# EAGLE design mainboard (EAGLE 5.11)
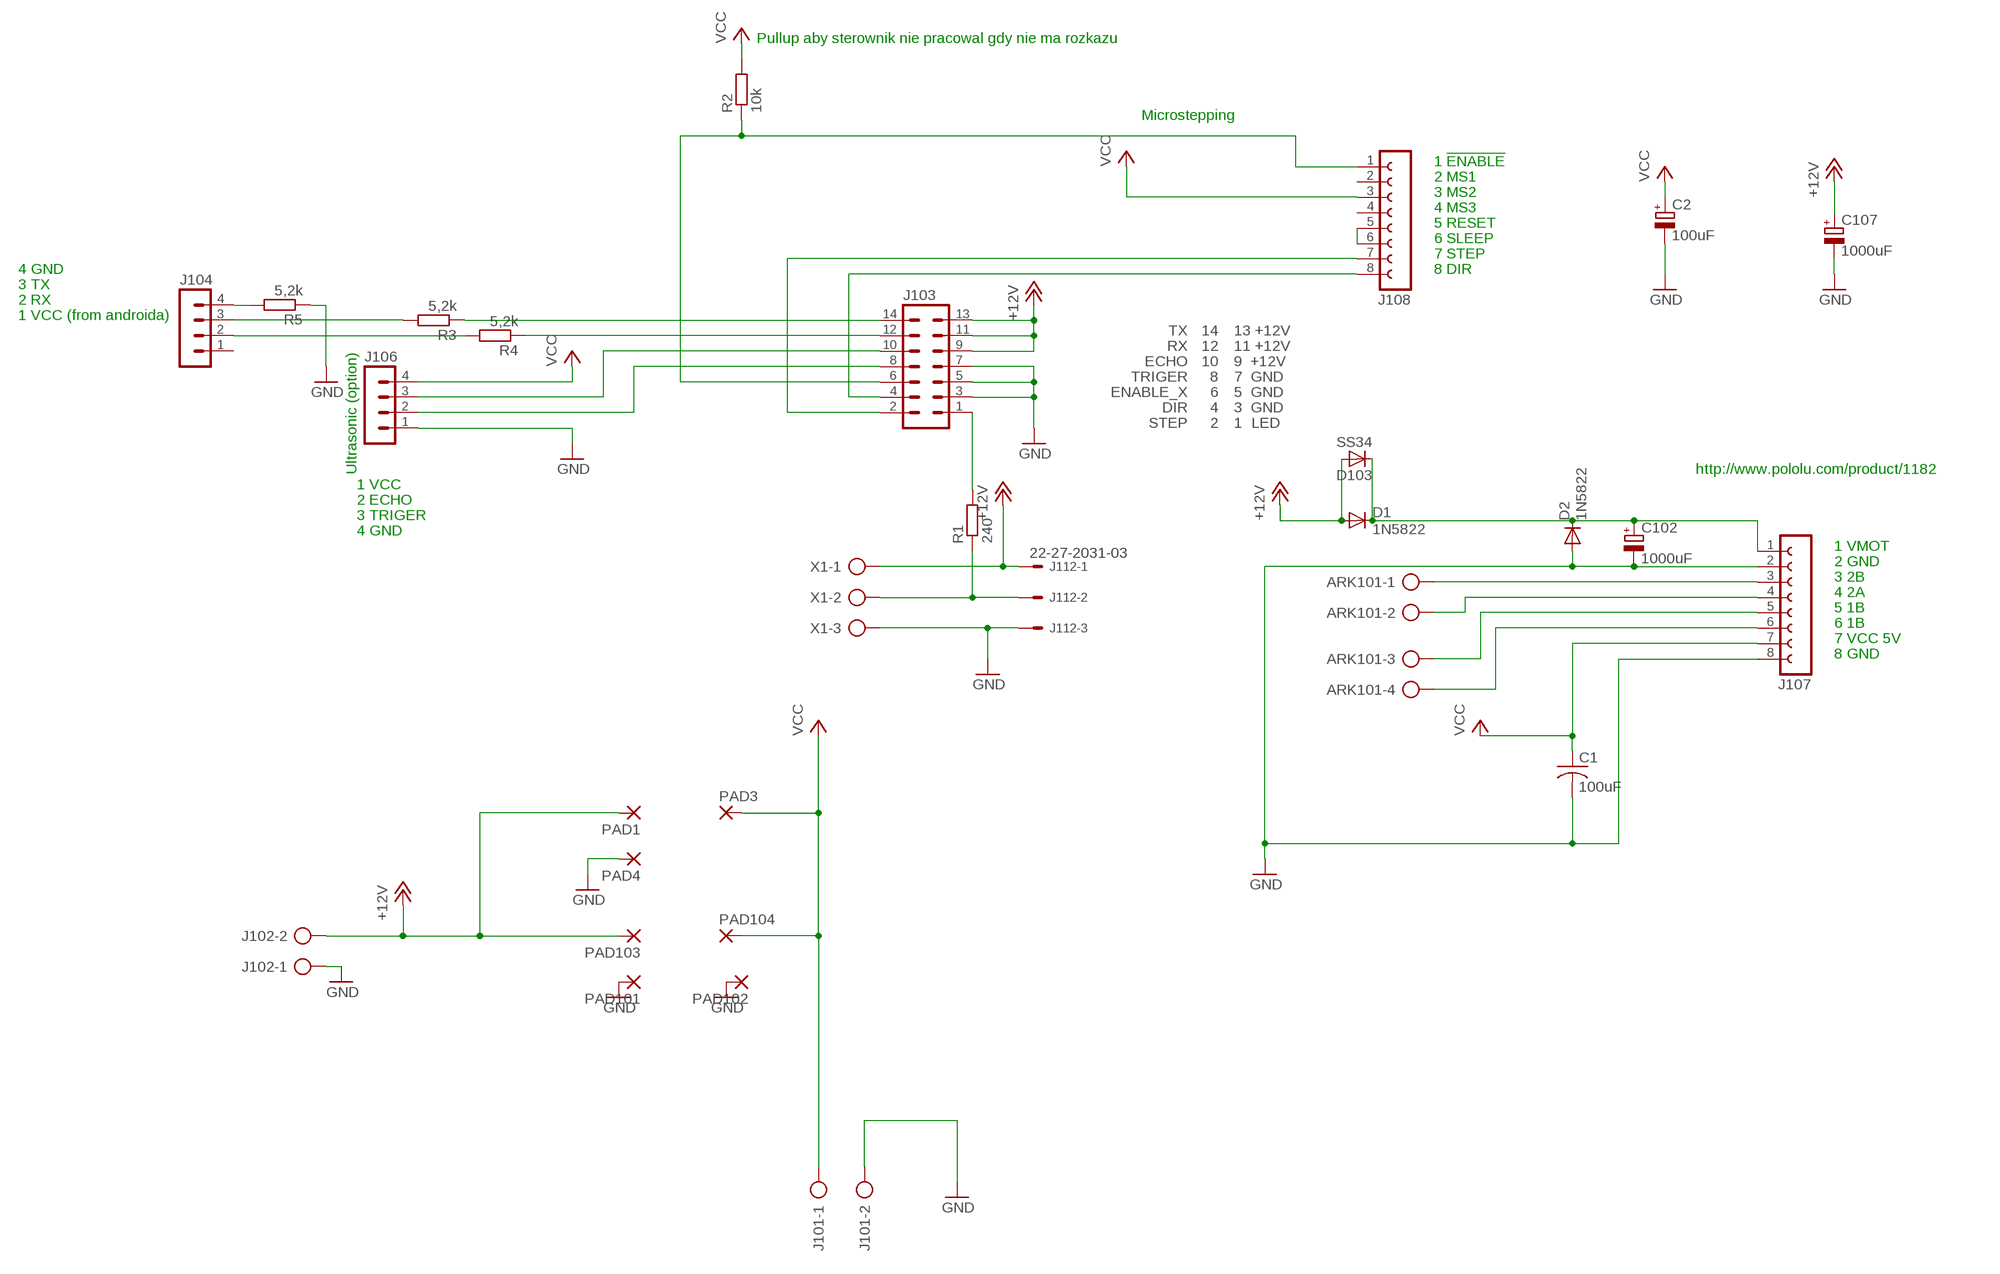
[diagram p0: schematic, sheet 1]

## Parts
ARK101  AK300/4  [AK300/4]
C1  100uF  C-US050-030X075  [C050-030X075]
C2  100uF  CPOL-EUE5-10.5  [E5-10,5]
C102  1000uF  CPOL-EUE5-10.5  [E5-10,5]
C107  1000uF  CPOL-EUE5-10.5  [E5-10,5]
D1  1N5822  DIODE-DO27-15  [DO27-15]
D2  1N5822  DIODE-DO27-15  [DO27-15]
D103  SS34  BYS10  [SOD106A]
J101  AK300/2  [AK300/2]
J102  AK300/2  [AK300/2]
J103  ML14  [ML14]
J104  MA04-1  [MA04-1]
J106  MA04-1  [MA04-1]
J107  FE08-1  [FE08]
J108  FE08-1  [FE08]
J112  22-27-2031-03  [6410-03]
PAD1  3,17/1,1  [3,17/1,1]
PAD3  3,17/1,1  [3,17/1,1]
PAD4  3,17/1,1  [3,17/1,1]
PAD101  3,17/1,1  [3,17/1,1]
PAD102  3,17/1,1  [3,17/1,1]
PAD103  3,17/1,1  [3,17/1,1]
PAD104  3,17/1,1  [3,17/1,1]
R1  240  R-EU_0207/12  [0207/12]
R2  10k  R-EU_0207/12  [0207/12]
R3  5,2k  R-EU_0207/12  [0207/12]
R4  5,2k  R-EU_0207/12  [0207/12]
R5  5,2k  R-EU_0207/12  [0207/12]
X1  AK300/3  [AK300/3]

## Nets
+12V [VCC12V]: C107.+ D1.A D103.A J102.2 J103.9 J103.11 J103.13 J112.1 PAD1.1(P) PAD103.1(P) X1.1
GND [Ground]: C1.2 C2.- C102.- C107.- D2.A J101.2 J102.1 J103.3 J103.5 J103.7 J106.1 J107.2 J107.8 J112.3 PAD4.1(P) PAD101.1(P) PAD102.1(P) R5.1 X1.3
JUMPER101: J103.6 J108.1 R2.1
MISO: J103.4 J108.8
N$1: J103.1 R1.2
N$2: J104.3 R3.2
N$3: J103.2 J108.7
N$4: J112.2 R1.1 X1.2
N$5: J103.10 J106.3
N$6: J103.8 J106.2
N$7: J103.14 R3.1
N$8: J103.12 R4.1
N$9: J104.2 R4.2
N$10: J104.4 R5.2
N$17 [MOTOR]: ARK101.1 J107.3
N$18 [MOTOR]: ARK101.2 J107.4
N$19 [MOTOR]: ARK101.3 J107.5
N$20: ARK101.4 J107.6
N$24: J108.5 J108.6
N$43 [VCC12V]: C102.+ D1.C D2.C D103.K J107.1
VCC: C1.1 C2.+ J101.1 J106.4 J107.7 J108.3 PAD3.1(P) PAD104.1(P) R2.2
Unconnected: J104.1 J108.2 J108.4

## Notes on the sheet
- Pullup aby sterownik nie pracowal gdy nie ma rozkazu
- Microstepping
- 1 !ENABLE
- 2 MS1
- 3 MS2
- 4 MS3
- 5 RESET
- 6 SLEEP
- 7 STEP
- 4 GND | 8 DIR
- 3 TX
- 2 RX
- 1 VCC (from androida)
- TX | 14 | 13 +12V
- RX | 12 | 11 +12V
- ECHO | 10 | 9  +12V
- TRIGER | 8 | 7  GND
- ENABLE_X | 6 | 5  GND
- DIR | 4 | 3  GND
- STEP | 2 | 1 | LED
- Ultrasonic (option) | http://www.pololu.com/product/1182
- 1 VCC
- 2 ECHO
- 3 TRIGER
- 4 GND
- 1 VMOT
- 2 GND
- 3 2B
- 4 2A
- 5 1B
- 6 1B
- 7 VCC 5V
- 8 GND

## Library data of the parts
ARK101 = con-ptr500:AK300/4: CONNECTOR; OC_FARNELL: unknown; OC_NEWARK: unknown
C1 = resistor:C-US: CAPACITOR, American symbol
C2 C102 C107 = rcl:CPOL-EU: POLARIZED CAPACITOR, European symbol
D1 D2 = diode:DIODE-: DIODE
D103 = telefunken:BYS10: DIODE; MPN: BYS10/45; OC_FARNELL: 9549188; OC_NEWARK: 96K7236
J101 J102 = con-ptr500:AK300/2: CONNECTOR; OC_FARNELL: unknown; OC_NEWARK: unknown
J103 = con-ml:ML14: HARTING; OC_FARNELL: unknown; OC_NEWARK: unknown
J104 J106 = con-lstb:MA04-1: PIN HEADER; OC_FARNELL: unknown; OC_NEWARK: unknown
J107 J108 = con-lsta:FE08-1: FEMALE HEADER; OC_FARNELL: unknown; OC_NEWARK: unknown
J112 = con-molex:22-?-03: CONNECTOR wire to board 2.54 mm (.1 inch) pitch header; OC_FARNELL: unknown; OC_NEWARK: unknown
PAD1 PAD3 PAD4 PAD101-PAD104 = wirepad:3,17/1,1: THROUGH-HOLE PAD
R1-R5 = rcl:R-EU_: RESISTOR, European symbol
X1 = con-ptr500:AK300/3: CONNECTOR; OC_FARNELL: unknown; OC_NEWARK: unknown

## Net classes
0 default: width 0.381 mm
1 VCC12V: width 2.54 mm, drill 1.27 mm, clearance 0.508 mm
2 Ground: width 0.508 mm, drill 0.508 mm
3 MOTOR: width 0.813 mm

## Board
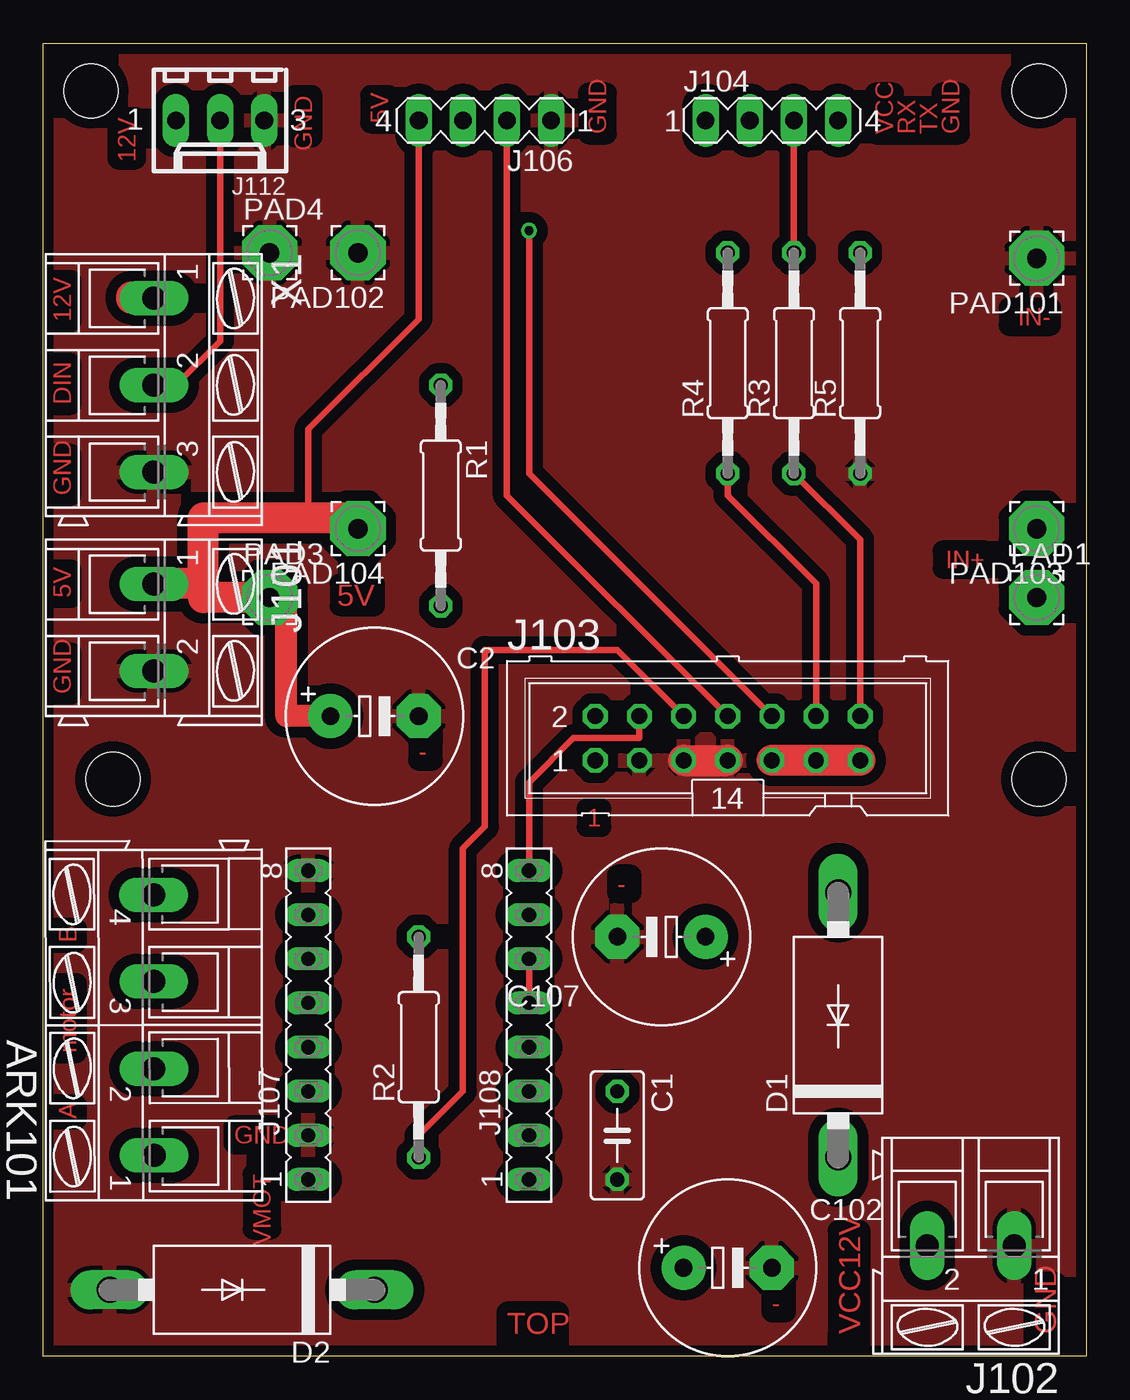
[diagram p1: board, top side]
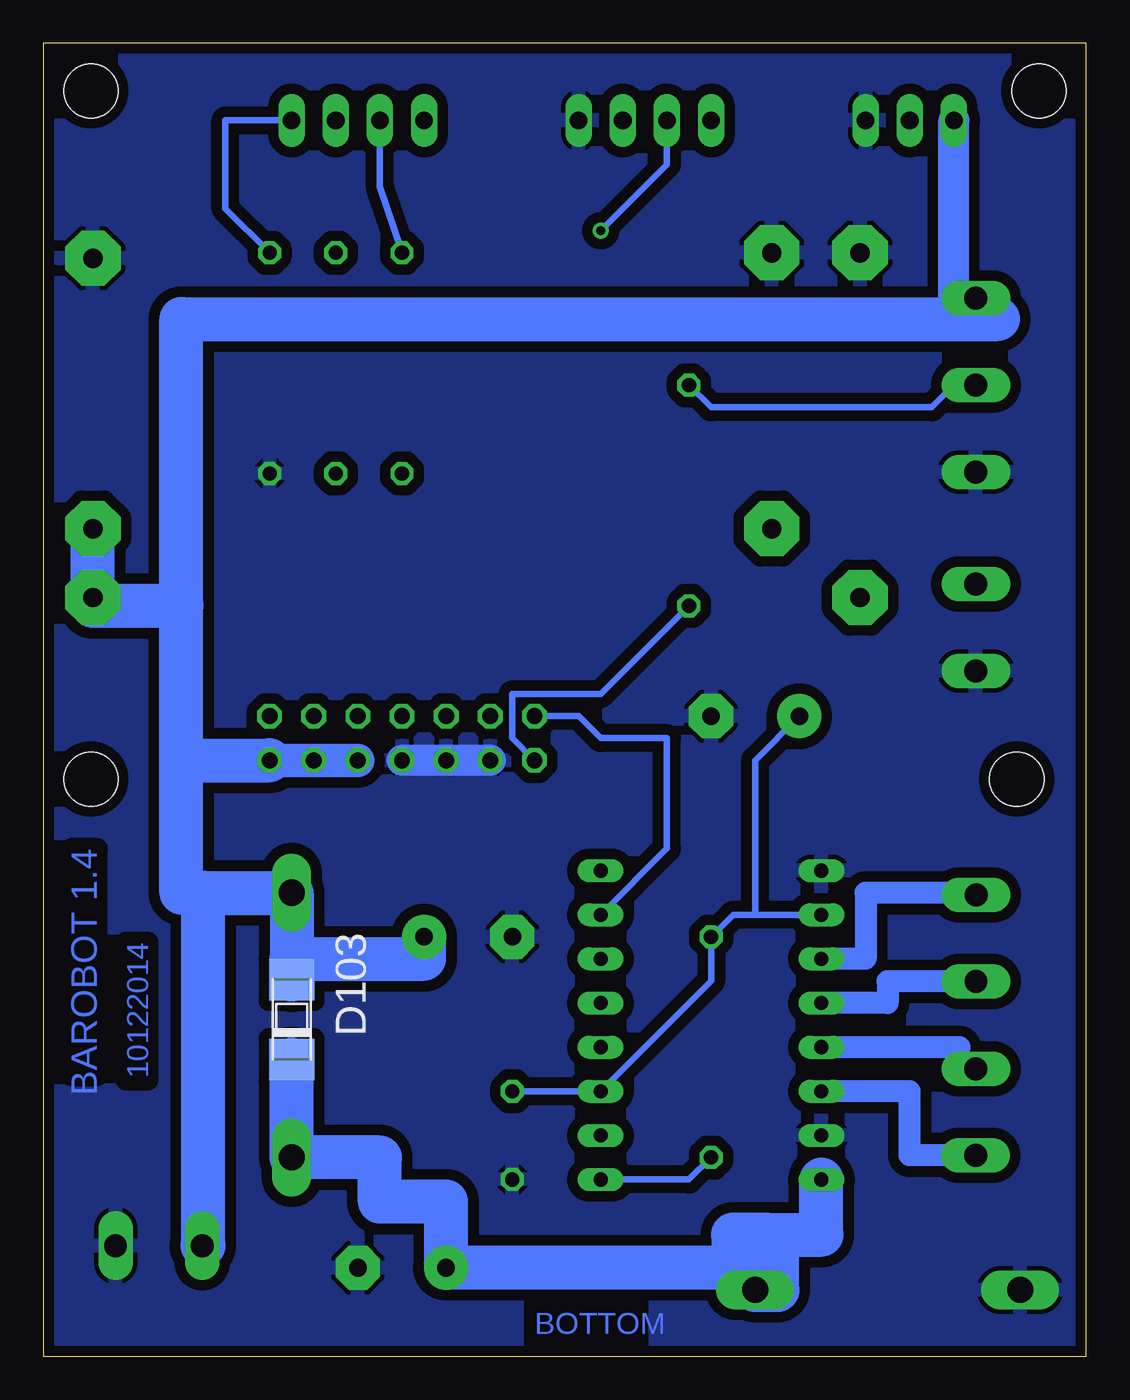
[diagram p2: board, bottom side, seen from below]

Size 60 x 75.55 mm. Coordinates in mm from the lower left corner, seen from the top.
Outline: 0,0 0,75.55 60,75.55 60,0 0,0
Copper layers (1*16): Top 0.035mm / dielectric 1.5mm / Bottom 0.035mm
Design rules "default *": minimum track width 10mil, minimum drill 0.5mm, track to track 8mil, track to pad 8mil, pad to pad 8mil, via to via 8mil, smd to smd 8mil, copper to edge 20mil, drill to drill 8mil, minimum pad ring 10mil, minimum via ring 8mil, stop-mask expansion 4mil, vias tented up to drill 0mil, thermal gap 10mil
Holes 3.1 mm at 4,33.21 57.27,33.21 57.27,72.82 2.73,72.82
tRestrict: area -7.6,69.7 to -5.1,70.2
bRestrict: area 37.5,78.6 to 38.7,81.1

### Footprints (pad centres in the part's own frame; a part is rotated, then mirrored left to right if it is on the bottom)
AK300/4 = drill 1.321 long: 1 -7.493,0; 2 -2.515,0; 3 2.515,0; 4 7.493,0
C050-030X075 = drill 0.813 octagon: 1 -2.54,0; 2 2.54,0
E5-10,5 = drill 1.016 pad 2.54 round: + -2.54,0 | drill 1.016 pad 2.54 octagon: - 2.54,0
DO27-15 = drill 1.499 long: A 7.62,0; C -7.62,0
SOD106A = smd 2.4 x 2.6: A 2.3,0; K -2.3,0
AK300/2 = drill 1.321 long: 1 -2.515,0; 2 2.489,0
ML14 = drill 0.914 octagon: 1 -7.62,-1.27; 2 -7.62,1.27; 3 -5.08,-1.27; 4 -5.08,1.27; 5 -2.54,-1.27; 6 -2.54,1.27; 7 0,-1.27; 8 0,1.27; 9 2.54,-1.27; 10 2.54,1.27; 11 5.08,-1.27; 12 5.08,1.27; 13 7.62,-1.27; 14 7.62,1.27
MA04-1 = drill 1.016 long: 1 -3.81,0; 2 -1.27,0; 3 1.27,0; 4 3.81,0
FE08 = drill 0.813 long: 1 -8.89,0; 2 -6.35,0; 3 -3.81,0; 4 -1.27,0; 5 1.27,0; 6 3.81,0; 7 6.35,0; 8 8.89,0
6410-03 = drill 1.016 long: 1 2.54,0; 2 0,0; 3 -2.54,0
3,17/1,1 = drill 1.118 pad 3.175 octagon: 1 0,0
0207/12 = drill 0.813 octagon: 1 -6.35,0; 2 6.35,0
AK300/3 = drill 1.321 long: 1 -5.004,0; 2 0,0; 3 5.004,0

### Placement (x,y rotation side)
ARK101  6.35,19.05 90.1 top
C1  33.02,12.7 270 top
C2  19.05,36.83 0 top
C102  39.37,5.08 0 top
C107  35.56,24.13 180 top
D1  45.72,19.05 90 top
D2  11.43,3.81 180 top
D103  45.72,19.37 90 bottom
J101  6.35,41.91 270 top
J102  53.34,6.35 180 top
J103  39.37,35.56 0 top
J104  41.91,71.12 0 top
J106  25.4,71.12 180 top
J107  15.24,19.05 90 top
J108  27.94,19.05 90 top
J112  10.16,71.12 180 top
PAD1  57.15,43.66 0 top
PAD3  13.02,43.66 0 top
PAD4  13.02,63.5 0 top
PAD101  57.15,63.18 180 top
PAD102  18.1,63.5 180 top
PAD103  57.15,47.62 180 top
PAD104  18.1,47.62 180 top
R1  22.86,49.53 270 top
R2  21.59,17.78 90 top
R3  43.18,57.15 90 top
R4  39.37,57.15 90 top
R5  46.99,57.15 90 top
X1  6.35,55.88 270 top

### Tracks (layer width: path | path; a pad name or v marks a point on that pad's centre or on a via)
+12V
  Top 1.778: J103.9 J103.11 J103.13 | X1.1 5.08,60.88 5.08,60.96
  Bottom 1.778: 5.08,59.69 6.35,59.69 X1.1 7.62,60.88 J112.1
  Bottom 1.93: J103.13 J103.9
  Bottom 2.54: 5.08,59.69 52.07,59.69 52.07,43.18 | 52.07,34.29 J103.13 | 52.07,34.29 52.07,26.67 50.8,26.67 | 45.72,22.86 D1.A 50.8,26.67 | J102.2 50.8,6.35 50.8,26.67 | 52.07,34.29 52.07,43.18 | 52.07,43.18 57.15,43.18 PAD1.1 PAD103.1 | C107.+ 38.1,22.86 45.72,22.86 | 45.72,22.86 D103.A
GND
  Top 1.778: J103.5 J103.7
  Bottom 1.778: J103.3 J103.5 J103.7
  pour Top (isolate 0.61): 0,74.93 59.69,74.93 59.69,0 0,0
  pour Bottom (isolate 0.61): 0,74.93 59.69,74.93 59.69,0 0,0
JUMPER101
  Top 0.381: J103.6 33.02,40.64 25.4,40.64 25.4,30.48 24.13,29.21 24.13,15.24 21.59,12.7 R2.1
  Bottom 0.381: R2.1 22.86,10.16 J108.1
MISO
  Top 0.381: J108.8 27.94,33.02 30.48,35.56 34.29,35.56 J103.4
N$1
  Bottom 0.381: R1.2 27.94,38.1 33.02,38.1 33.02,35.56 J103.1
N$2
  Top 0.381: R3.2 J104.3
N$3
  Bottom 0.381: J108.7 24.13,29.21 24.13,35.56 27.94,35.56 29.21,36.83 J103.2
N$4
  Top 0.381: J112.2 10.16,58.42 7.62,55.88 X1.2
  Bottom 0.381: R1.1 21.59,54.61 8.89,54.61 7.62,55.88 X1.2
N$5  (via drill 0.5)
  Top 0.381: J103.10 27.94,50.8 v27.94,64.77
  Bottom 0.381: v27.94,64.77 24.13,68.58 J106.3
N$6
  Top 0.381: J103.8 26.67,49.53 J106.2
N$7
  Top 0.381: R3.1 46.99,46.99 J103.14
N$8
  Top 0.381: R4.1 39.37,49.53 44.45,44.45 J103.12
N$9
  Bottom 0.381: R4.2 40.64,67.31 J104.2
N$10
  Bottom 0.381: R5.2 49.53,66.04 49.53,71.12 J104.4
N$17
  Bottom 1.27: J107.3 10.16,15.24 10.16,11.56 ARK101.1
N$18
  Bottom 1.27: J107.4 7.3,17.78 7.3,16.54 ARK101.2
N$19
  Bottom 1.27: J107.5 11.43,20.32 11.43,21.56 ARK101.3
N$20
  Bottom 0.813: ARK101.4 5.08,26.54 5.08,26.67
  Bottom 1.27: J107.6 12.7,22.86 12.7,26.67 5.08,26.67
N$24
  Top 0.381: J108.5 J108.6
N$43
  Bottom 2.54: 18.41,6.99 18.41,6.35 17.78,6.35 17.78,3.81 D2.C | 18.41,6.99 15.24,6.99 J107.1 | D103.K D1.C 40.64,11.43 40.64,8.89 36.83,8.89 C102.+ 20.32,5.08 20.32,6.99 18.41,6.99
VCC
  Top 0.381: J106.4 21.59,59.69 15.24,53.34 15.24,48.26 | 13.97,43.18 PAD3.1
  Top 1.27: C2.+ 13.97,36.83 13.97,43.18
  Top 1.778: 9.21,44.45 6.35,44.45 J101.1 | 9.21,44.45 9.21,48.26 15.24,48.26 18.1,48.26 PAD104.1 | PAD3.1 9.21,43.66 9.21,44.45
  Bottom 0.381: C1.1 J108.3 21.59,21.59 R2.2 20.32,25.4 19.05,25.4 | J107.7 19.05,25.4 | 19.05,25.4 19.05,34.29 C2.+

### Text on the board
Top: GND | 12V | 5V | GND | VCC | RX | TX | GND | IN- | 12V | DIN | GND | IN+ | 5V | 5V | GND | - | 1 | - | B | motor | A | GND | VMOT | - | TOP | VCC12V | GND
Bottom: BAROBOT 1.4 | 10122014 | BOTTOM